# Altium schematic sheet Sheet1.SchDoc
size A1; SheetNumber: 1; SheetTotal: 1
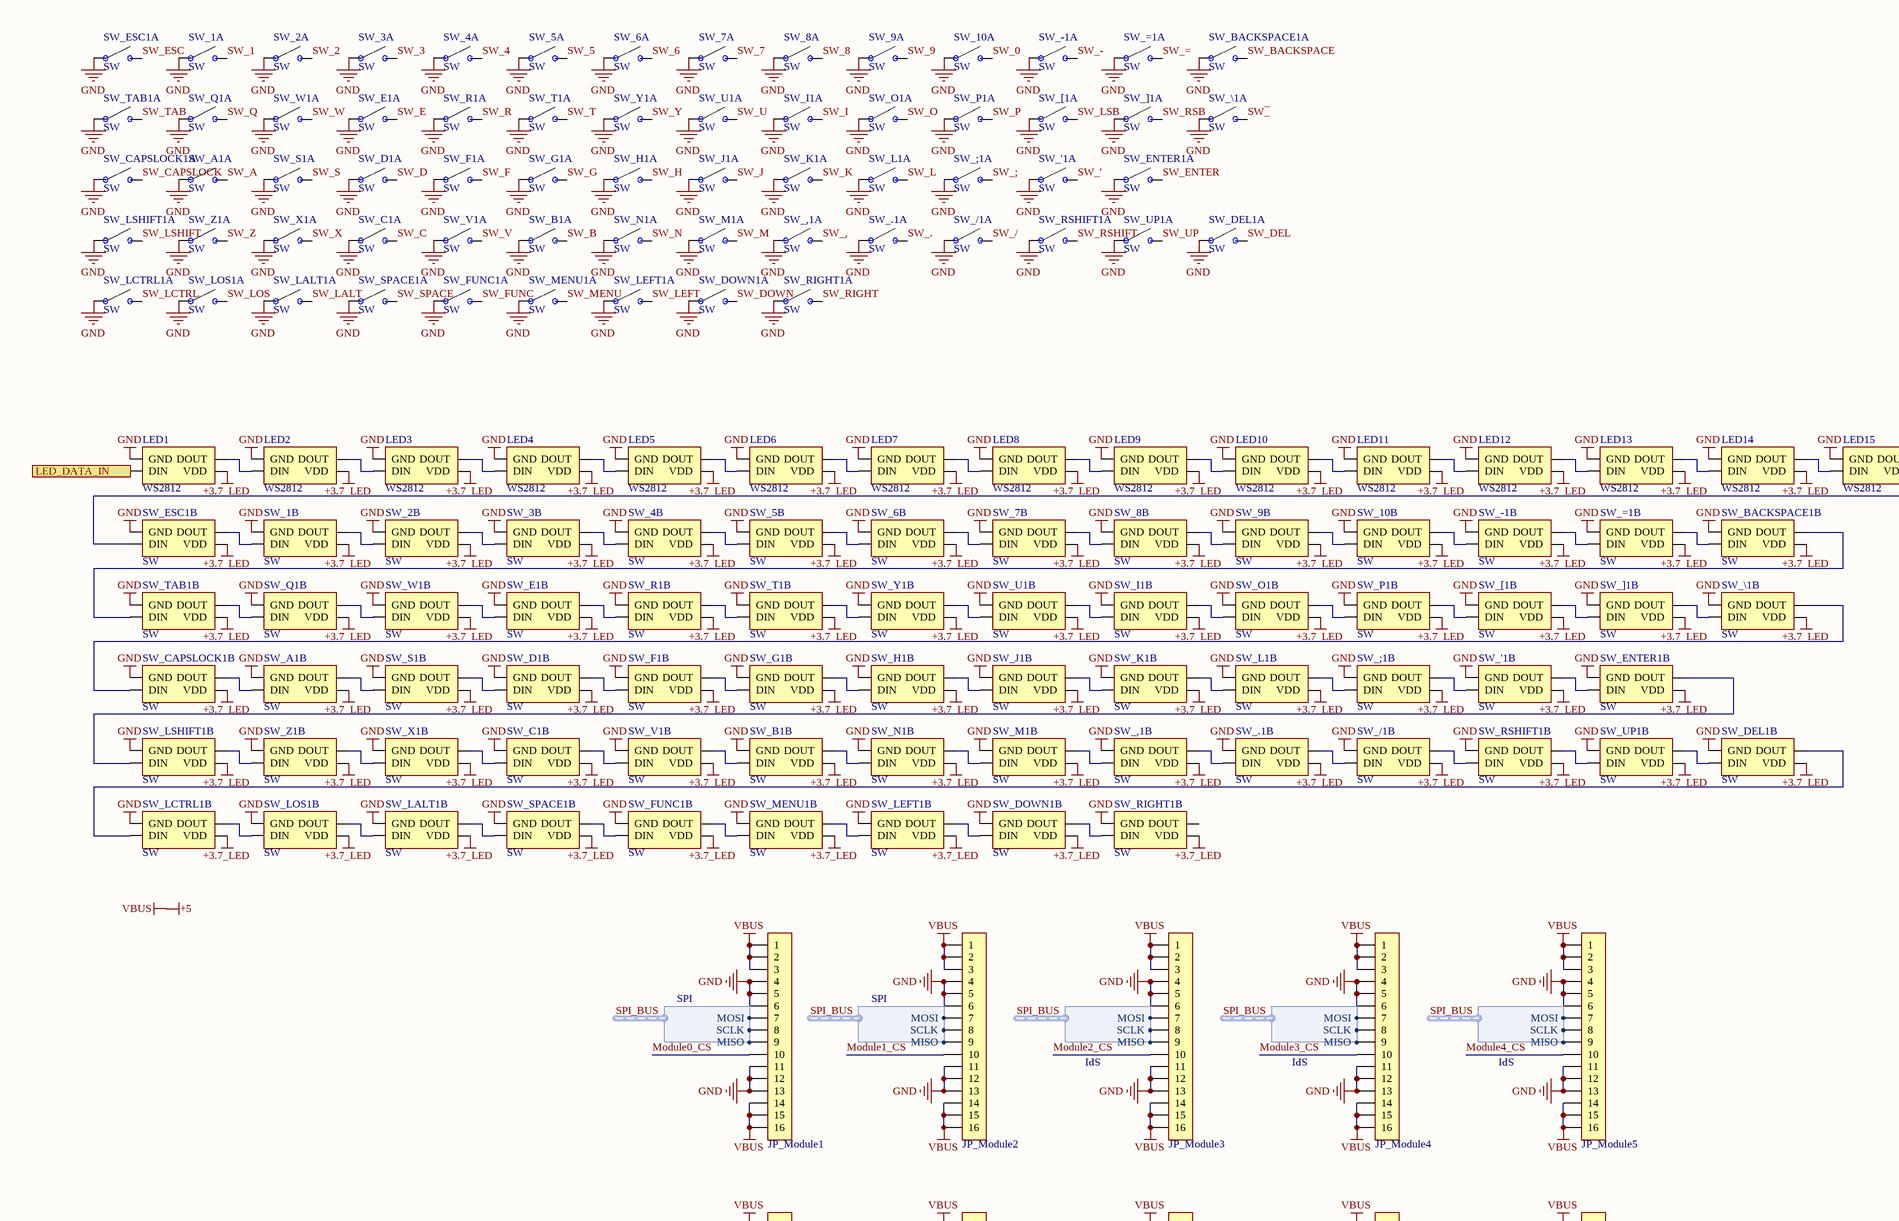
[diagram p0: Sheet1.SchDoc, top left]
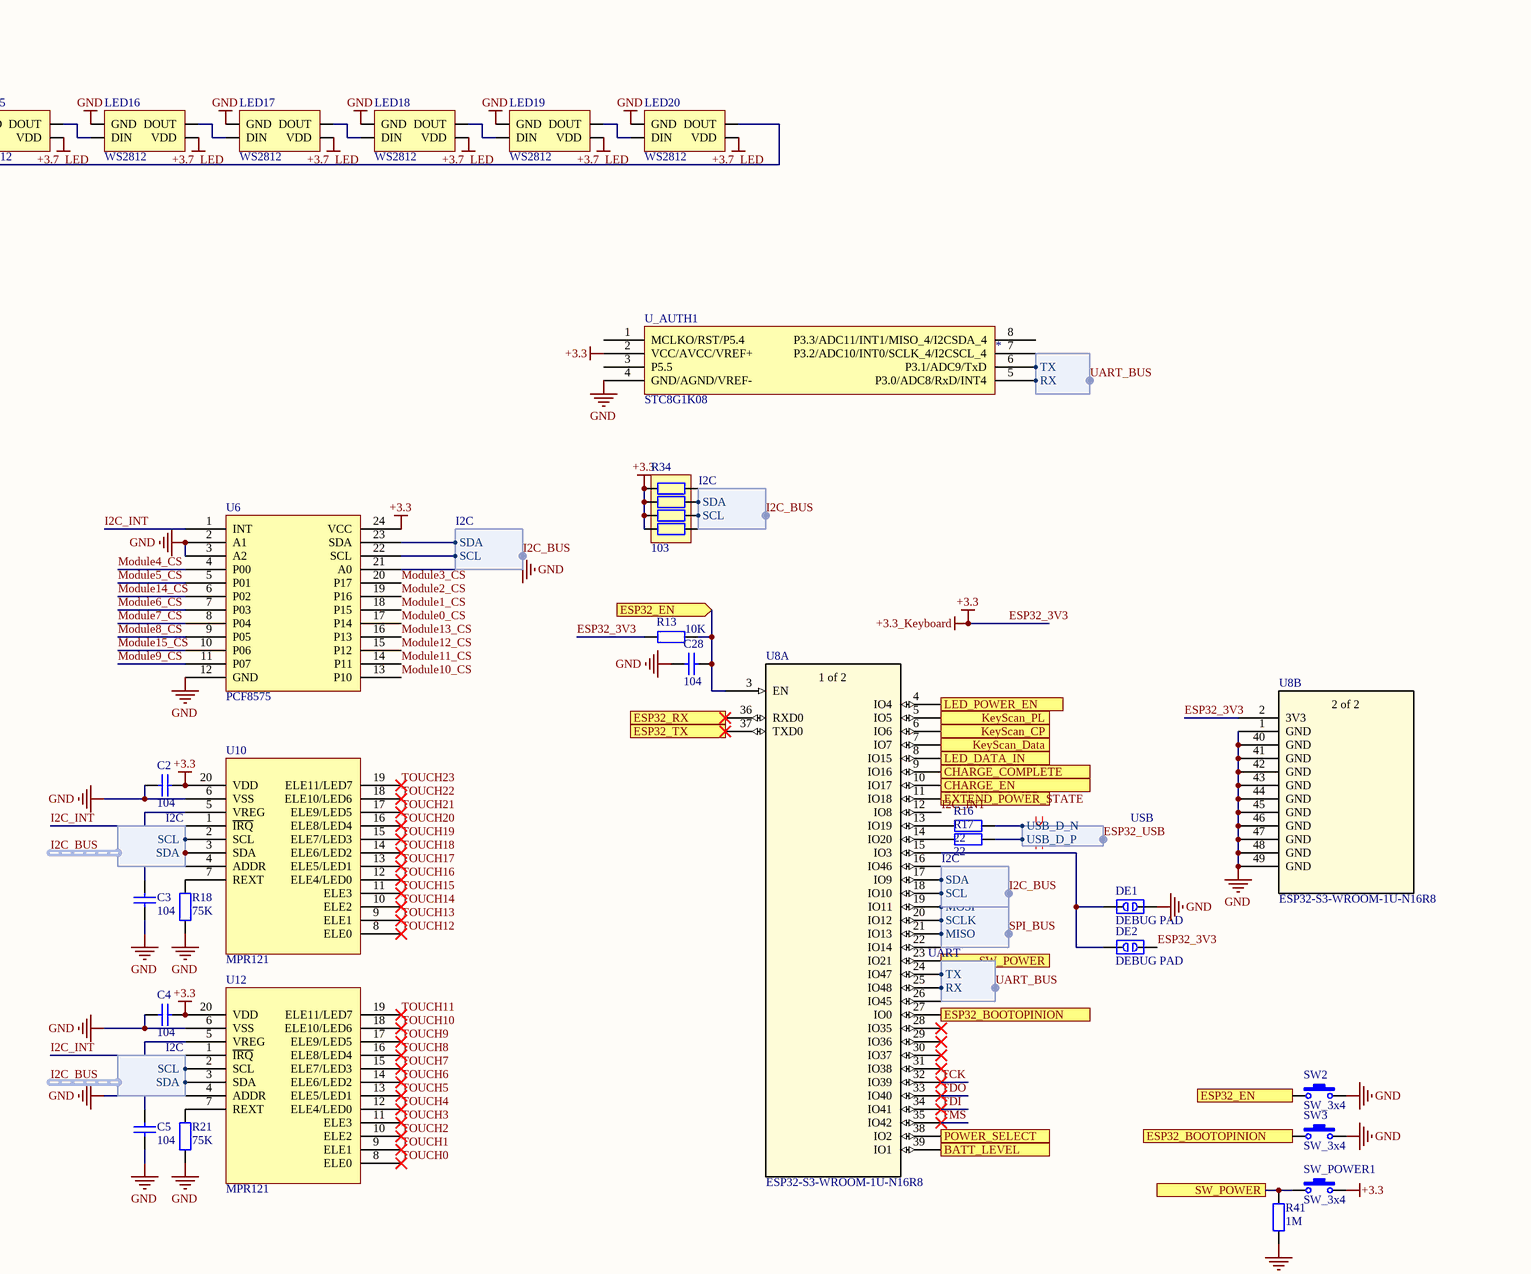
[diagram p1: Sheet1.SchDoc, top middle]
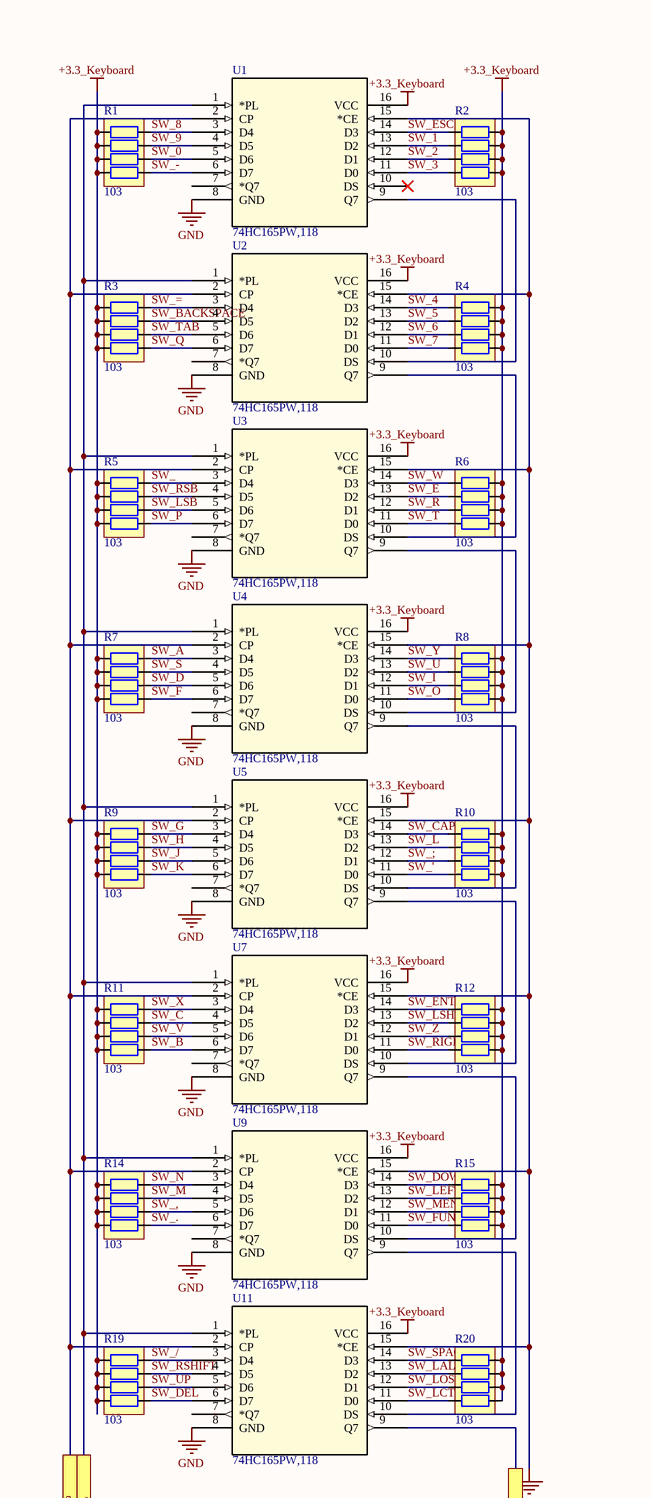
[diagram p2: Sheet1.SchDoc, top right]
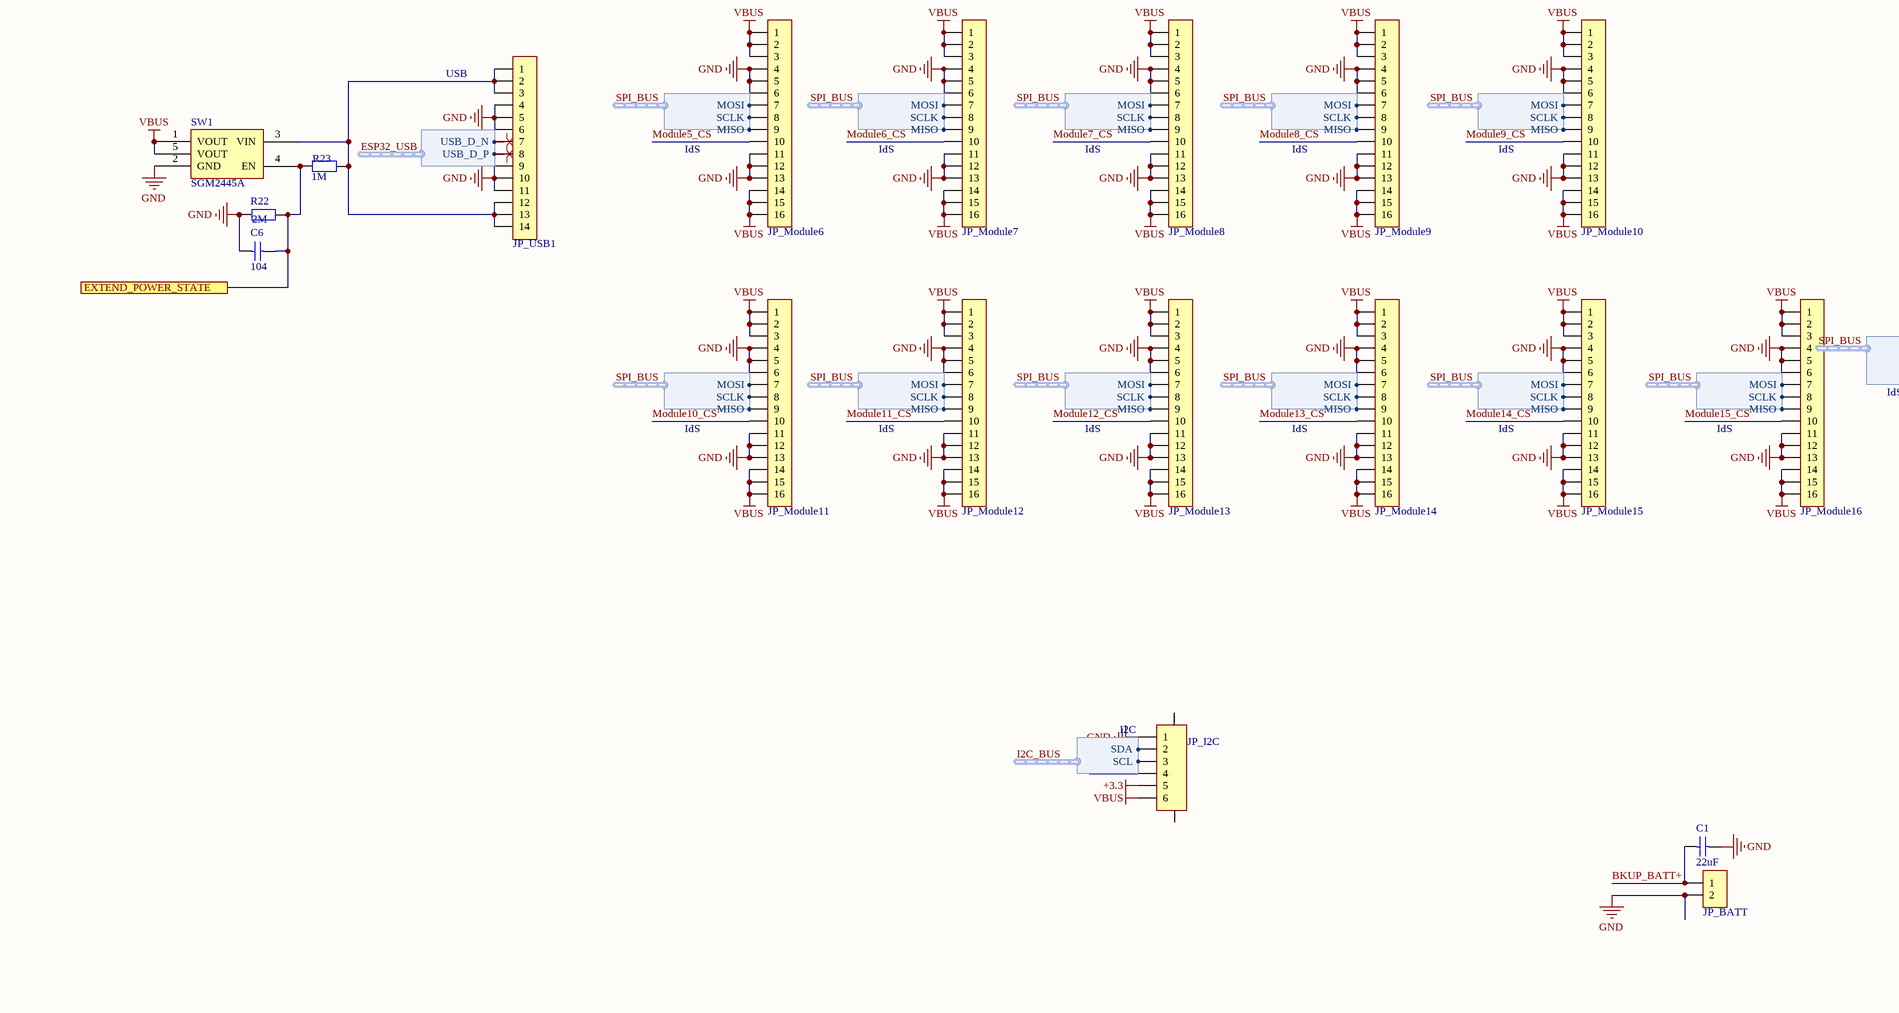
[diagram p3: Sheet1.SchDoc, bottom left]
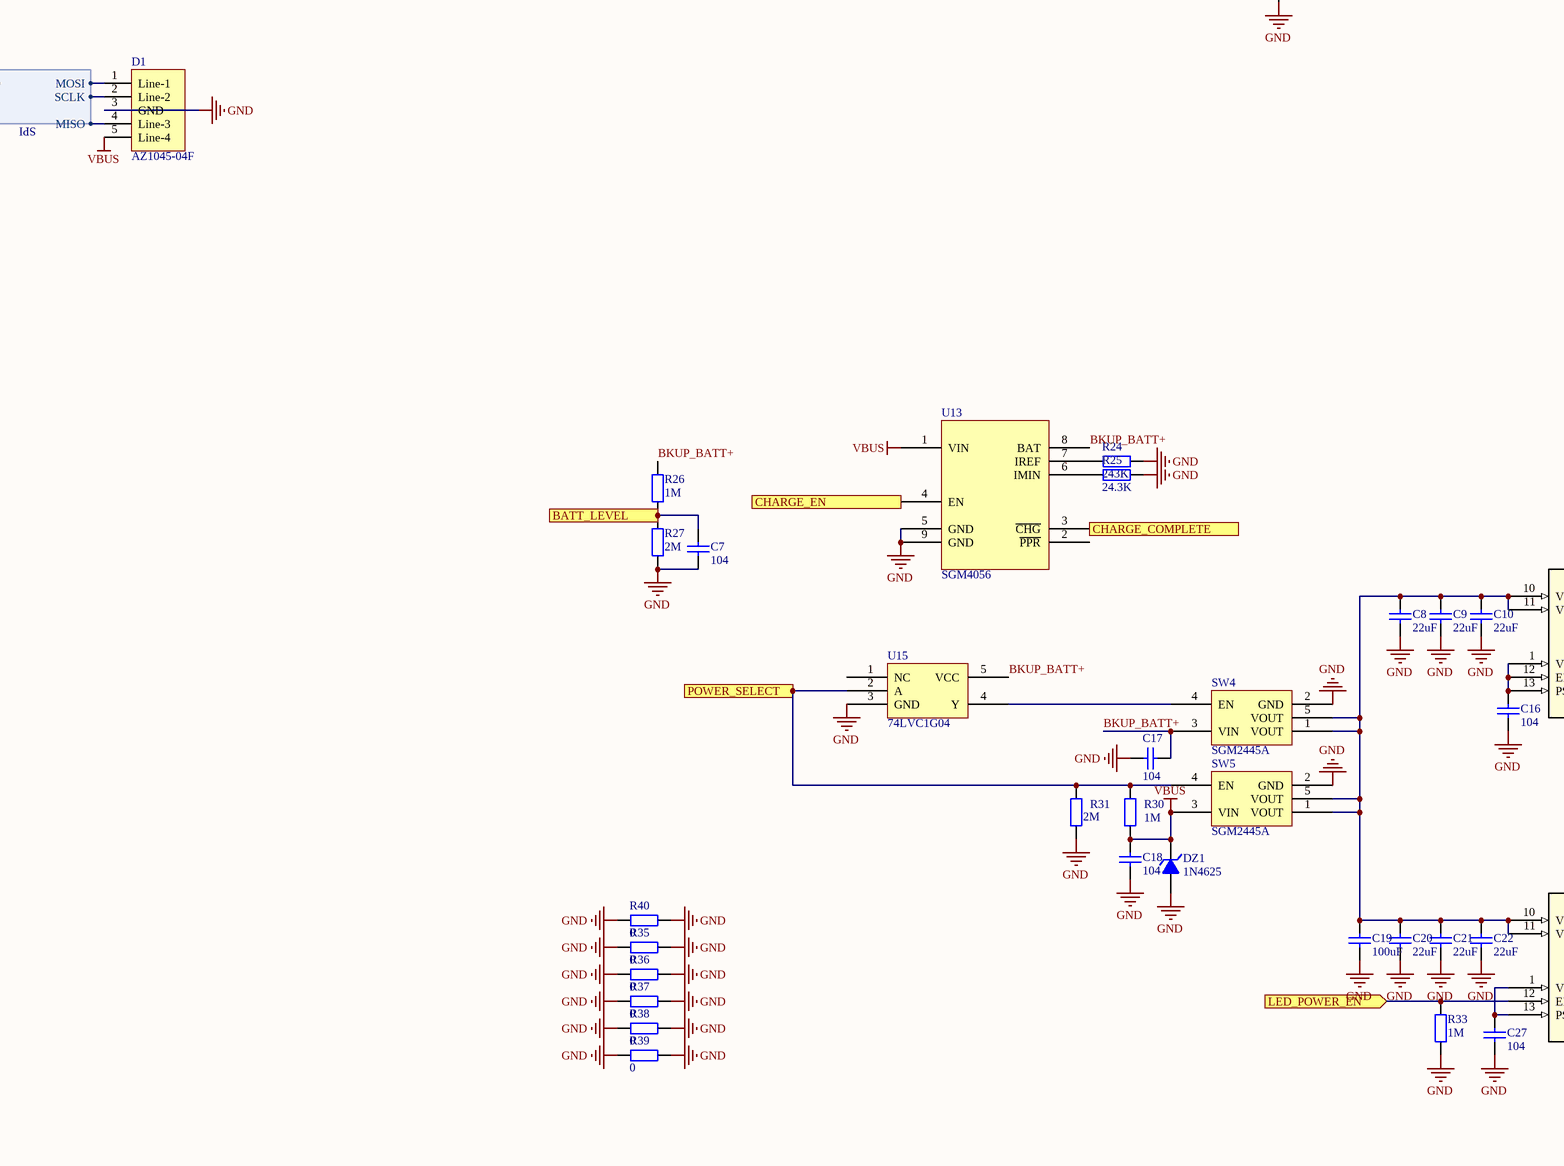
[diagram p4: Sheet1.SchDoc, bottom middle]
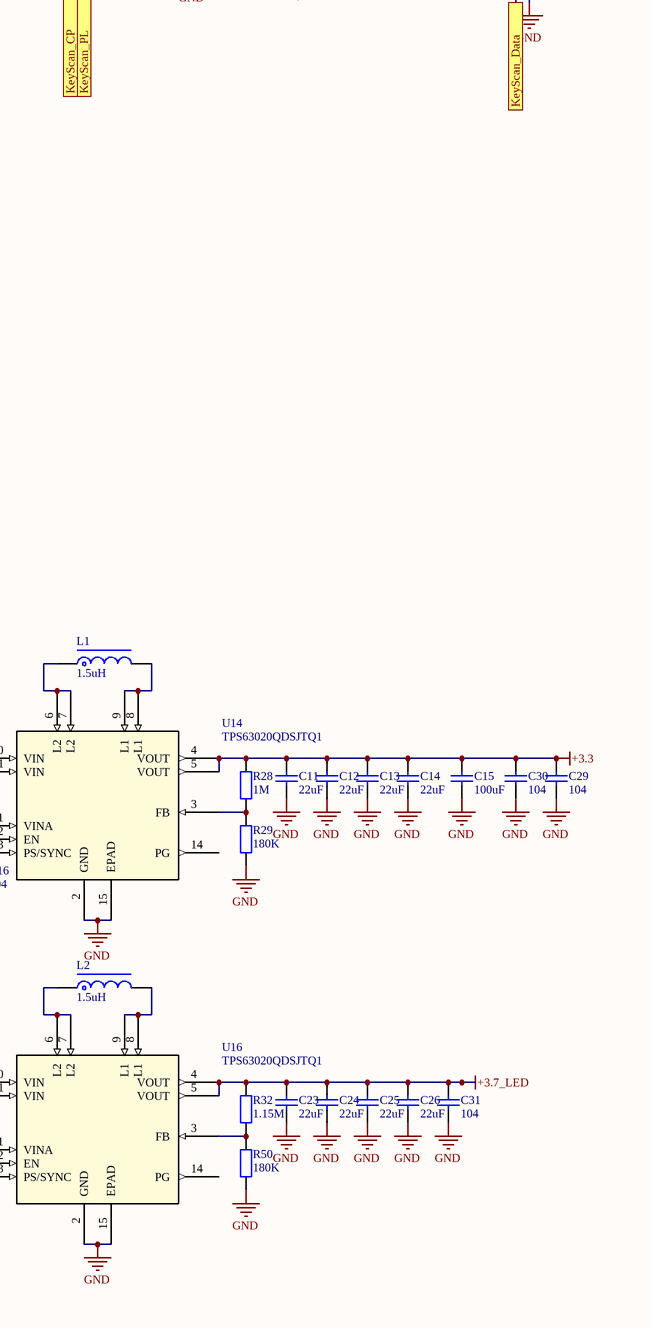
[diagram p5: Sheet1.SchDoc, bottom right]

## Parts
C1  22uF  [C0603_L_NS]
C2  104  [C0603_L_NS]
C3  104  [C0603_L_NS]
C4  104  [C0603_L_NS]
C5  104  [C0603_L_NS]
C6  104  [C0603_L_NS]
C7  104  [C0603_L_NS]
C8  22uF  [C0603_L_NS]
C9  22uF  [C0603_L_NS]
C10  22uF  [C0603_L_NS]
C11  22uF  [C0603_L_NS]
C12  22uF  [C0603_L_NS]
C13  22uF  [C0603_L_NS]
C14  22uF  [C0603_L_NS]
C15  100uF  [C1206_L]
C16  104  [C0603_L_NS]
C17  104  [C0603_L_NS]
C18  104  [C0603_L_NS]
C19  100uF  [C1206_L]
C20  22uF  [C0603_L_NS]
C21  22uF  [C0603_L_NS]
C22  22uF  [C0603_L_NS]
C23  22uF  [C0603_L_NS]
C24  22uF  [C0603_L_NS]
C25  22uF  [C0603_L_NS]
C26  22uF  [C0603_L_NS]
C27  104  [C0603_L_NS]
C28  104  [C0603_L_NS]
C29  104  [C0603_L_NS]
C30  104  [C0603_L_NS]
C31  104  [C0603_L_NS]
D1  AZ1045-04F  [ESD10]
DE1  DEBUG PAD  [DEBUG_B]
DE2  DEBUG PAD  [DEBUG_B]
DZ1  1N4625  [MINI_MELF (LL34)]
JP_BATT  HDR-1X2  [MX1.25-WS-2P]  (value not drawn)
JP_I2C  CON-6P  [FPC0.5-WT-6P]  (value not drawn)
JP_Module1  FPC1.0-16P  [FPC0.5 2H-WS-16P]  (value not drawn)
JP_Module2  FPC1.0-16P  [FPC0.5 2H-WS-16P]  (value not drawn)
JP_Module3  FPC1.0-16P  [FPC0.5 2H-WS-16P]  (value not drawn)
JP_Module4  FPC1.0-16P  [FPC0.5 2H-WS-16P]  (value not drawn)
JP_Module5  FPC1.0-16P  [FPC0.5 2H-WS-16P]  (value not drawn)
JP_Module6  FPC1.0-16P  [FPC0.5 2H-WS-16P]  (value not drawn)
JP_Module7  FPC1.0-16P  [FPC0.5 2H-WS-16P]  (value not drawn)
JP_Module8  FPC1.0-16P  [FPC0.5 2H-WS-16P]  (value not drawn)
JP_Module9  FPC1.0-16P  [FPC0.5 2H-WS-16P]  (value not drawn)
JP_Module10  FPC1.0-16P  [FPC0.5 2H-WS-16P]  (value not drawn)
JP_Module11  FPC1.0-16P  [FPC0.5 2H-WS-16P]  (value not drawn)
JP_Module12  FPC1.0-16P  [FPC0.5 2H-WS-16P]  (value not drawn)
JP_Module13  FPC1.0-16P  [FPC0.5 2H-WS-16P]  (value not drawn)
JP_Module14  FPC1.0-16P  [FPC0.5 2H-WS-16P]  (value not drawn)
JP_Module15  FPC1.0-16P  [FPC0.5 2H-WS-16P]  (value not drawn)
JP_Module16  FPC1.0-16P  [FPC0.5 2H-WS-16P]  (value not drawn)
JP_USB1  FPC1.0-14P  [FPC0.5 2H-WS-14P]  (value not drawn)
L1  1.5uH  [L-SMD-0420]
L2  1.5uH  [L-SMD-0420]
LED1  WS2812  [LED 3528-4Pin]
LED2  WS2812  [LED 3528-4Pin]
LED3  WS2812  [LED 3528-4Pin]
LED4  WS2812  [LED 3528-4Pin]
LED5  WS2812  [LED 3528-4Pin]
LED6  WS2812  [LED 3528-4Pin]
LED7  WS2812  [LED 3528-4Pin]
LED8  WS2812  [LED 3528-4Pin]
LED9  WS2812  [LED 3528-4Pin]
LED10  WS2812  [LED 3528-4Pin]
LED11  WS2812  [LED 3528-4Pin]
LED12  WS2812  [LED 3528-4Pin]
LED13  WS2812  [LED 3528-4Pin]
LED14  WS2812  [LED 3528-4Pin]
LED15  WS2812  [LED 3528-4Pin]
LED16  WS2812  [LED 3528-4Pin]
LED17  WS2812  [LED 3528-4Pin]
LED18  WS2812  [LED 3528-4Pin]
LED19  WS2812  [LED 3528-4Pin]
LED20  WS2812  [LED 3528-4Pin]
R1  103  [RCA-8P4R-0402]
R2  103  [RCA-8P4R-0402]
R3  103  [RCA-8P4R-0402]
R4  103  [RCA-8P4R-0402]
R5  103  [RCA-8P4R-0402]
R6  103  [RCA-8P4R-0402]
R7  103  [RCA-8P4R-0402]
R8  103  [RCA-8P4R-0402]
R9  103  [RCA-8P4R-0402]
R10  103  [RCA-8P4R-0402]
R11  103  [RCA-8P4R-0402]
R12  103  [RCA-8P4R-0402]
R13  10K  [R0603_L_NS]
R14  103  [RCA-8P4R-0402]
R15  103  [RCA-8P4R-0402]
R16  22  [R0603_L_NS]
R17  22  [R0603_L_NS]
R18  75K  [R0603_L_NS]
R19  103  [RCA-8P4R-0402]
R20  103  [RCA-8P4R-0402]
R21  75K  [R0603_L_NS]
R22  2M  [R0603_L_NS]
R23  1M  [R0603_L_NS]
R24  243K  [R0603_L_NS]
R25  24.3K  [R0603_L_NS]
R26  1M  [R0603_L_NS]
R27  2M  [R0603_L_NS]
R28  1M  [R0603_L_NS]
R29  180K  [R0603_L_NS]
R30  1M  [R0603_L_NS]
R31  2M  [R0603_L_NS]
R32  1.15M  [R0603_L_NS]
R33  1M  [R0603_L_NS]
R34  103  [RCA-8P4R-0402]
R35  0  [R2010_L]
R36  0  [R2010_L]
R37  0  [R2010_L]
R38  0  [R2010_L]
R39  0  [R2010_L]
R40  0  [R2010_L]
R41  1M  [R0603_L_NS]
R50  180K  [R0603_L_NS]
SW1  SGM2445A  [SOT23-5N]
SW2  SW_3x4  [SW 3*4]
SW3  SW_3x4  [SW 3*4]
SW4  SGM2445A  [SOT23-5L]
SW5  SGM2445A  [SOT23-5L]
SW_1  SW  [KeyboardSwitchModule]  (parts A,B of 2)
SW_2  SW  [KeyboardSwitchModule]  (parts A,B of 2)
SW_3  SW  [KeyboardSwitchModule]  (parts A,B of 2)
SW_4  SW  [KeyboardSwitchModule]  (parts A,B of 2)
SW_5  SW  [KeyboardSwitchModule]  (parts A,B of 2)
SW_6  SW  [KeyboardSwitchModule]  (parts A,B of 2)
SW_7  SW  [KeyboardSwitchModule]  (parts A,B of 2)
SW_8  SW  [KeyboardSwitchModule]  (parts A,B of 2)
SW_9  SW  [KeyboardSwitchModule]  (parts A,B of 2)
SW_10  SW  [KeyboardSwitchModule]  (parts A,B of 2)
SW_'1  SW  [KeyboardSwitchModule]  (parts A,B of 2)
SW_,1  SW  [KeyboardSwitchModule]  (parts A,B of 2)
SW_-1  SW  [KeyboardSwitchModule]  (parts A,B of 2)
SW_.1  SW  [KeyboardSwitchModule]  (parts A,B of 2)
SW_/1  SW  [KeyboardSwitchModule]  (parts A,B of 2)
SW_;1  SW  [KeyboardSwitchModule]  (parts A,B of 2)
SW_=1  SW  [KeyboardSwitchModule]  (parts A,B of 2)
SW_[1  SW  [KeyboardSwitchModule]  (parts A,B of 2)
SW_\1  SW  [KeyboardSwitchModule]  (parts A,B of 2)
SW_]1  SW  [KeyboardSwitchModule]  (parts A,B of 2)
SW_A1  SW  [KeyboardSwitchModule]  (parts A,B of 2)
SW_B1  SW  [KeyboardSwitchModule]  (parts A,B of 2)
SW_BACKSPACE1  SW  [KeyboardSwitchModule]  (parts A,B of 2)
SW_C1  SW  [KeyboardSwitchModule]  (parts A,B of 2)
SW_CAPSLOCK1  SW  [KeyboardSwitchModule]  (parts A,B of 2)
SW_D1  SW  [KeyboardSwitchModule]  (parts A,B of 2)
SW_DEL1  SW  [KeyboardSwitchModule]  (parts A,B of 2)
SW_DOWN1  SW  [KeyboardSwitchModule]  (parts A,B of 2)
SW_E1  SW  [KeyboardSwitchModule]  (parts A,B of 2)
SW_ENTER1  SW  [KeyboardSwitchModule]  (parts A,B of 2)
SW_ESC1  SW  [KeyboardSwitchModule]  (parts A,B of 2)
SW_F1  SW  [KeyboardSwitchModule]  (parts A,B of 2)
SW_FUNC1  SW  [KeyboardSwitchModule]  (parts A,B of 2)
SW_G1  SW  [KeyboardSwitchModule]  (parts A,B of 2)
SW_H1  SW  [KeyboardSwitchModule]  (parts A,B of 2)
SW_I1  SW  [KeyboardSwitchModule]  (parts A,B of 2)
SW_J1  SW  [KeyboardSwitchModule]  (parts A,B of 2)
SW_K1  SW  [KeyboardSwitchModule]  (parts A,B of 2)
SW_L1  SW  [KeyboardSwitchModule]  (parts A,B of 2)
SW_LALT1  SW  [KeyboardSwitchModule]  (parts A,B of 2)
SW_LCTRL1  SW  [KeyboardSwitchModule]  (parts A,B of 2)
SW_LEFT1  SW  [KeyboardSwitchModule]  (parts A,B of 2)
SW_LOS1  SW  [KeyboardSwitchModule]  (parts A,B of 2)
SW_LSHIFT1  SW  [KeyboardSwitchModule]  (parts A,B of 2)
SW_M1  SW  [KeyboardSwitchModule]  (parts A,B of 2)
SW_MENU1  SW  [KeyboardSwitchModule]  (parts A,B of 2)
SW_N1  SW  [KeyboardSwitchModule]  (parts A,B of 2)
SW_O1  SW  [KeyboardSwitchModule]  (parts A,B of 2)
SW_P1  SW  [KeyboardSwitchModule]  (parts A,B of 2)
SW_POWER1  SW_3x4  [SW 3*4]
SW_Q1  SW  [KeyboardSwitchModule]  (parts A,B of 2)
SW_R1  SW  [KeyboardSwitchModule]  (parts A,B of 2)
SW_RIGHT1  SW  [KeyboardSwitchModule]  (parts A,B of 2)
SW_RSHIFT1  SW  [KeyboardSwitchModule]  (parts A,B of 2)
SW_S1  SW  [KeyboardSwitchModule]  (parts A,B of 2)
SW_SPACE1  SW  [KeyboardSwitchModule]  (parts A,B of 2)
SW_T1  SW  [KeyboardSwitchModule]  (parts A,B of 2)
SW_TAB1  SW  [KeyboardSwitchModule]  (parts A,B of 2)
SW_U1  SW  [KeyboardSwitchModule]  (parts A,B of 2)
SW_UP1  SW  [KeyboardSwitchModule]  (parts A,B of 2)
SW_V1  SW  [KeyboardSwitchModule]  (parts A,B of 2)
SW_W1  SW  [KeyboardSwitchModule]  (parts A,B of 2)
SW_X1  SW  [KeyboardSwitchModule]  (parts A,B of 2)
SW_Y1  SW  [KeyboardSwitchModule]  (parts A,B of 2)
SW_Z1  SW  [KeyboardSwitchModule]  (parts A,B of 2)
U1  74HC165PW,118  [TSSOP16_N]
U2  74HC165PW,118  [TSSOP16_N]
U3  74HC165PW,118  [TSSOP16_N]
U4  74HC165PW,118  [TSSOP16_N]
U5  74HC165PW,118  [TSSOP16_N]
U6  PCF8575  [SSOP24_N]
U7  74HC165PW,118  [TSSOP16_N]
U8  ESP32-S3-WROOM-1U-N16R8  [ESP32璖3璚ROOM?U_EXP]  (parts A,B of 2)
U9  74HC165PW,118  [TSSOP16_N]
U10  MPR121  [QFN20 3X3]
U11  74HC165PW,118  [TSSOP16_N]
U12  MPR121  [QFN20 3X3]
U13  SGM4056  [TDFN-2*2-8L]
U14  TPS63020QDSJTQ1  [DSJ14_2P85X1P58_TEX]
U15  74LVC1G04  [SOT23-5L]
U16  TPS63020QDSJTQ1  [DSJ14_2P85X1P58_TEX]
U_AUTH1  STC8G1K08  [TDFN-3*3-8L]

## Ports
BATT_LEVEL, CHARGE_COMPLETE, CHARGE_EN, ESP32_BOOTOPINION (in), ESP32_BOOTOPINION (out), ESP32_EN (in), ESP32_EN (out), ESP32_RX (in), ESP32_TX (out), EXTEND_POWER_STATE, KeyScan_CP, KeyScan_Data, KeyScan_PL, LED_DATA_IN (in), LED_DATA_IN (out), LED_POWER_EN (in), POWER_SELECT, SW_POWER

## Harnesses
SPI: SCLK, MISO, MOSI
SPI: SCLK, MOSI, MISO
USB: USB_D_P, USB_D_N
I2C: SCL, SDA
*: TX, RX
UART: TX, RX

## Nets
+3.7_LED: C23.2 C24.2 C25.2 C26.2 C31.2 LED1.3(VDD) LED2.3(VDD) LED3.3(VDD) LED4.3(VDD) LED5.3(VDD) LED6.3(VDD) LED7.3(VDD) LED8.3(VDD) LED9.3(VDD) LED10.3(VDD) LED11.3(VDD) LED12.3(VDD) LED13.3(VDD) LED14.3(VDD) LED15.3(VDD) LED16.3(VDD) LED17.3(VDD) LED18.3(VDD) LED19.3(VDD) LED20.3(VDD) R32.2 SW_1.5(VDD) SW_2.5(VDD) SW_3.5(VDD) SW_4.5(VDD) SW_5.5(VDD) SW_6.5(VDD) SW_7.5(VDD) SW_8.5(VDD) SW_9.5(VDD) SW_10.5(VDD) SW_'1.5(VDD) SW_,1.5(VDD) SW_-1.5(VDD) SW_.1.5(VDD) SW_/1.5(VDD) SW_;1.5(VDD) SW_=1.5(VDD) SW_[1.5(VDD) SW_\1.5(VDD) SW_]1.5(VDD) SW_A1.5(VDD) SW_B1.5(VDD) SW_BACKSPACE1.5(VDD) SW_C1.5(VDD) SW_CAPSLOCK1.5(VDD) SW_D1.5(VDD) SW_DEL1.5(VDD) SW_DOWN1.5(VDD) SW_E1.5(VDD) SW_ENTER1.5(VDD) SW_ESC1.5(VDD) SW_F1.5(VDD) SW_FUNC1.5(VDD) SW_G1.5(VDD) SW_H1.5(VDD) SW_I1.5(VDD) SW_J1.5(VDD) SW_K1.5(VDD) SW_L1.5(VDD) SW_LALT1.5(VDD) SW_LCTRL1.5(VDD) SW_LEFT1.5(VDD) SW_LOS1.5(VDD) SW_LSHIFT1.5(VDD) SW_M1.5(VDD) SW_MENU1.5(VDD) SW_N1.5(VDD) SW_O1.5(VDD) SW_P1.5(VDD) SW_Q1.5(VDD) SW_R1.5(VDD) SW_RIGHT1.5(VDD) SW_RSHIFT1.5(VDD) SW_S1.5(VDD) SW_SPACE1.5(VDD) SW_T1.5(VDD) SW_TAB1.5(VDD) SW_U1.5(VDD) SW_UP1.5(VDD) SW_V1.5(VDD) SW_W1.5(VDD) SW_X1.5(VDD) SW_Y1.5(VDD) SW_Z1.5(VDD) U16.4(VOUT) U16.5(VOUT)
+5: C18.2 D1.5(Line-4) DZ1.2(K) JP_I2C.6 JP_Module1.1 JP_Module1.2 JP_Module1.3 JP_Module1.14 JP_Module1.15 JP_Module1.16 JP_Module2.1 JP_Module2.2 JP_Module2.3 JP_Module2.14 JP_Module2.15 JP_Module2.16 JP_Module3.1 JP_Module3.2 JP_Module3.3 JP_Module3.14 JP_Module3.15 JP_Module3.16 JP_Module4.1 JP_Module4.2 JP_Module4.3 JP_Module4.14 JP_Module4.15 JP_Module4.16 JP_Module5.1 JP_Module5.2 JP_Module5.3 JP_Module5.14 JP_Module5.15 JP_Module5.16 JP_Module6.1 JP_Module6.2 JP_Module6.3 JP_Module6.14 JP_Module6.15 JP_Module6.16 JP_Module7.1 JP_Module7.2 JP_Module7.3 JP_Module7.14 JP_Module7.15 JP_Module7.16 JP_Module8.1 JP_Module8.2 JP_Module8.3 JP_Module8.14 JP_Module8.15 JP_Module8.16 JP_Module9.1 JP_Module9.2 JP_Module9.3 JP_Module9.14 JP_Module9.15 JP_Module9.16 JP_Module10.1 JP_Module10.2 JP_Module10.3 JP_Module10.14 JP_Module10.15 JP_Module10.16 JP_Module11.1 JP_Module11.2 JP_Module11.3 JP_Module11.14 JP_Module11.15 JP_Module11.16 JP_Module12.1 JP_Module12.2 JP_Module12.3 JP_Module12.14 JP_Module12.15 JP_Module12.16 JP_Module13.1 JP_Module13.2 JP_Module13.3 JP_Module13.14 JP_Module13.15 JP_Module13.16 JP_Module14.1 JP_Module14.2 JP_Module14.3 JP_Module14.14 JP_Module14.15 JP_Module14.16 JP_Module15.1 JP_Module15.2 JP_Module15.3 JP_Module15.14 JP_Module15.15 JP_Module15.16 JP_Module16.1 JP_Module16.2 JP_Module16.3 JP_Module16.14 JP_Module16.15 JP_Module16.16 R30.2 SW1.1(VOUT) SW1.5(VOUT) SW5.3(VIN) U13.1(VIN)  [also labelled VBUS]
ESP32_3V3: C2.2 C4.2 C11.2 C12.2 C13.2 C14.2 C15.2 C29.2 C30.2 DE2.2 JP_I2C.5 R1.1 R1.2 R1.3 R1.4 R2.5 R2.6 R2.7 R2.8 R3.1 R3.2 R3.3 R3.4 R4.5 R4.6 R4.7 R4.8 R5.1 R5.2 R5.3 R5.4 R6.5 R6.6 R6.7 R6.8 R7.1 R7.2 R7.3 R7.4 R8.5 R8.6 R8.7 R8.8 R9.1 R9.2 R9.3 R9.4 R10.5 R10.6 R10.7 R10.8 R11.1 R11.2 R11.3 R11.4 R12.5 R12.6 R12.7 R12.8 R13.1 R14.1 R14.2 R14.3 R14.4 R15.5 R15.6 R15.7 R15.8 R19.1 R19.2 R19.3 R19.4 R20.5 R20.6 R20.7 R20.8 R28.2 R34.1 R34.2 R34.3 R34.4 SW_POWER1.2 U1.16(VCC) U2.16(VCC) U3.16(VCC) U4.16(VCC) U5.16(VCC) U6.24(VCC) U7.16(VCC) U8.2(3V3) U9.16(VCC) U10.20(VDD) U11.16(VCC) U12.20(VDD) U14.4(VOUT) U14.5(VOUT) U_AUTH1.2(VCC/AVCC/VREF+)  [also labelled +3.3, +3.3_Keyboard]
GND: C1.1 C2.1 C3.1 C4.1 C5.1 C6.1 C7.1 C8.1 C9.1 C10.1 C11.1 C12.1 C13.1 C14.1 C15.1 C16.1 C17.2 C18.1 C19.1 C20.1 C21.1 C22.1 C23.1 C24.1 C25.1 C26.1 C27.1 C28.1 C29.1 C30.1 C31.1 D1.3(GND) DE1.2 DZ1.1(A) JP_BATT.2 JP_I2C.1 JP_Module1.4 JP_Module1.5 JP_Module1.6 JP_Module1.11 JP_Module1.12 JP_Module1.13 JP_Module2.4 JP_Module2.5 JP_Module2.6 JP_Module2.11 JP_Module2.12 JP_Module2.13 JP_Module3.4 JP_Module3.5 JP_Module3.6 JP_Module3.11 JP_Module3.12 JP_Module3.13 JP_Module4.4 JP_Module4.5 JP_Module4.6 JP_Module4.11 JP_Module4.12 JP_Module4.13 JP_Module5.4 JP_Module5.5 JP_Module5.6 JP_Module5.11 JP_Module5.12 JP_Module5.13 JP_Module6.4 JP_Module6.5 JP_Module6.6 JP_Module6.11 JP_Module6.12 JP_Module6.13 JP_Module7.4 JP_Module7.5 JP_Module7.6 JP_Module7.11 JP_Module7.12 JP_Module7.13 JP_Module8.4 JP_Module8.5 JP_Module8.6 JP_Module8.11 JP_Module8.12 JP_Module8.13 JP_Module9.4 JP_Module9.5 JP_Module9.6 JP_Module9.11 JP_Module9.12 JP_Module9.13 JP_Module10.4 JP_Module10.5 JP_Module10.6 JP_Module10.11 JP_Module10.12 JP_Module10.13 JP_Module11.4 JP_Module11.5 JP_Module11.6 JP_Module11.11 JP_Module11.12 JP_Module11.13 JP_Module12.4 JP_Module12.5 JP_Module12.6 JP_Module12.11 JP_Module12.12 JP_Module12.13 JP_Module13.4 JP_Module13.5 JP_Module13.6 JP_Module13.11 JP_Module13.12 JP_Module13.13 JP_Module14.4 JP_Module14.5 JP_Module14.6 JP_Module14.11 JP_Module14.12 JP_Module14.13 JP_Module15.4 JP_Module15.5 JP_Module15.6 JP_Module15.11 JP_Module15.12 JP_Module15.13 JP_Module16.4 JP_Module16.5 JP_Module16.6 JP_Module16.11 JP_Module16.12 JP_Module16.13 JP_USB1.4 JP_USB1.5 JP_USB1.6 JP_USB1.9 JP_USB1.10 JP_USB1.11 LED1.1(GND) LED2.1(GND) LED3.1(GND) LED4.1(GND) LED5.1(GND) LED6.1(GND) LED7.1(GND) LED8.1(GND) LED9.1(GND) LED10.1(GND) LED11.1(GND) LED12.1(GND) LED13.1(GND) LED14.1(GND) LED15.1(GND) LED16.1(GND) LED17.1(GND) LED18.1(GND) LED19.1(GND) LED20.1(GND) R18.1 R21.1 R22.1 R24.2 R25.2 R27.1 R29.1 R31.1 R33.1 R35.1 R35.2 R36.1 R36.2 R37.1 R37.2 R38.1 R38.2 R39.1 R39.2 R40.1 R40.2 R41.1 R50.1 SW1.2(GND) SW2.2 SW3.2 SW4.2(GND) SW5.2(GND) SW_1.1 SW_1.3(GND) SW_1.7(GND) SW_2.1 SW_2.3(GND) SW_2.7(GND) SW_3.1 SW_3.3(GND) SW_3.7(GND) SW_4.1 SW_4.3(GND) SW_4.7(GND) SW_5.1 SW_5.3(GND) SW_5.7(GND) SW_6.1 SW_6.3(GND) SW_6.7(GND) SW_7.1 SW_7.3(GND) SW_7.7(GND) SW_8.1 SW_8.3(GND) SW_8.7(GND) SW_9.1 SW_9.3(GND) SW_9.7(GND) SW_10.1 SW_10.3(GND) SW_10.7(GND) SW_'1.1 SW_'1.3(GND) SW_'1.7(GND) SW_,1.1 SW_,1.3(GND) SW_,1.7(GND) SW_-1.1 SW_-1.3(GND) SW_-1.7(GND) SW_.1.1 SW_.1.3(GND) SW_.1.7(GND) SW_/1.1 SW_/1.3(GND) SW_/1.7(GND) SW_;1.1 SW_;1.3(GND) SW_;1.7(GND) SW_=1.1 SW_=1.3(GND) SW_=1.7(GND) SW_[1.1 SW_[1.3(GND) SW_[1.7(GND) SW_\1.1 SW_\1.3(GND) SW_\1.7(GND) SW_]1.1 SW_]1.3(GND) SW_]1.7(GND) SW_A1.1 SW_A1.3(GND) SW_A1.7(GND) SW_B1.1 SW_B1.3(GND) SW_B1.7(GND) SW_BACKSPACE1.1 SW_BACKSPACE1.3(GND) SW_BACKSPACE1.7(GND) SW_C1.1 SW_C1.3(GND) SW_C1.7(GND) SW_CAPSLOCK1.1 SW_CAPSLOCK1.3(GND) SW_CAPSLOCK1.7(GND) SW_D1.1 SW_D1.3(GND) SW_D1.7(GND) SW_DEL1.1 SW_DEL1.3(GND) SW_DEL1.7(GND) SW_DOWN1.1 SW_DOWN1.3(GND) SW_DOWN1.7(GND) SW_E1.1 SW_E1.3(GND) SW_E1.7(GND) SW_ENTER1.1 SW_ENTER1.3(GND) SW_ENTER1.7(GND) SW_ESC1.1 SW_ESC1.3(GND) SW_ESC1.7(GND) SW_F1.1 SW_F1.3(GND) SW_F1.7(GND) SW_FUNC1.1 SW_FUNC1.3(GND) SW_FUNC1.7(GND) SW_G1.1 SW_G1.3(GND) SW_G1.7(GND) SW_H1.1 SW_H1.3(GND) SW_H1.7(GND) SW_I1.1 SW_I1.3(GND) SW_I1.7(GND) SW_J1.1 SW_J1.3(GND) SW_J1.7(GND) SW_K1.1 SW_K1.3(GND) SW_K1.7(GND) SW_L1.1 SW_L1.3(GND) SW_L1.7(GND) SW_LALT1.1 SW_LALT1.3(GND) SW_LALT1.7(GND) SW_LCTRL1.1 SW_LCTRL1.3(GND) SW_LCTRL1.7(GND) SW_LEFT1.1 SW_LEFT1.3(GND) SW_LEFT1.7(GND) SW_LOS1.1 SW_LOS1.3(GND) SW_LOS1.7(GND) SW_LSHIFT1.1 SW_LSHIFT1.3(GND) SW_LSHIFT1.7(GND) SW_M1.1 SW_M1.3(GND) SW_M1.7(GND) SW_MENU1.1 SW_MENU1.3(GND) SW_MENU1.7(GND) SW_N1.1 SW_N1.3(GND) SW_N1.7(GND) SW_O1.1 SW_O1.3(GND) SW_O1.7(GND) SW_P1.1 SW_P1.3(GND) SW_P1.7(GND) SW_Q1.1 SW_Q1.3(GND) SW_Q1.7(GND) SW_R1.1 SW_R1.3(GND) SW_R1.7(GND) SW_RIGHT1.1 SW_RIGHT1.3(GND) SW_RIGHT1.7(GND) SW_RSHIFT1.1 SW_RSHIFT1.3(GND) SW_RSHIFT1.7(GND) SW_S1.1 SW_S1.3(GND) SW_S1.7(GND) SW_SPACE1.1 SW_SPACE1.3(GND) SW_SPACE1.7(GND) SW_T1.1 SW_T1.3(GND) SW_T1.7(GND) SW_TAB1.1 SW_TAB1.3(GND) SW_TAB1.7(GND) SW_U1.1 SW_U1.3(GND) SW_U1.7(GND) SW_UP1.1 SW_UP1.3(GND) SW_UP1.7(GND) SW_V1.1 SW_V1.3(GND) SW_V1.7(GND) SW_W1.1 SW_W1.3(GND) SW_W1.7(GND) SW_X1.1 SW_X1.3(GND) SW_X1.7(GND) SW_Y1.1 SW_Y1.3(GND) SW_Y1.7(GND) SW_Z1.1 SW_Z1.3(GND) SW_Z1.7(GND) U1.8(GND) U1.15(*CE) U2.8(GND) U2.15(*CE) U3.8(GND) U3.15(*CE) U4.8(GND) U4.15(*CE) U5.8(GND) U5.15(*CE) U6.2(A1) U6.3(A2) U6.12(GND) U6.21(A0) U7.8(GND) U7.15(*CE) U8.1(GND) U8.40(GND) U8.41(GND) U8.42(GND) U8.43(GND) U8.44(GND) U8.45(GND) U8.46(GND) U8.47(GND) U8.48(GND) U8.49(GND) U9.8(GND) U9.15(*CE) U10.6(VSS) U11.8(GND) U11.15(*CE) U12.4(ADDR) U12.6(VSS) U13.5(GND) U13.9(GND) U14.2(GND) U14.15(EPAD) U15.3(GND) U16.2(GND) U16.15(EPAD) U_AUTH1.4(GND/AGND/VREF-)
BATT_LEVEL: C7.2 R26.1 R27.2 U8.39(IO1) ; port BATT_LEVEL
BKUP_BATT+: C1.2 C17.1 JP_BATT.1 R26.2 SW4.3(VIN) U13.8(BAT) U15.5(VCC)
CHARGE_COMPLETE: U8.9(IO16) U13.3(~{CHG}) ; port CHARGE_COMPLETE
CHARGE_EN: U8.10(IO17) U13.4(EN) ; port CHARGE_EN
ESP32_BOOTOPINION: SW3.1 U8.27(IO0) ; port ESP32_BOOTOPINION
ESP32_EN: C28.2 R13.2 SW2.1 U8.3(EN) ; port ESP32_EN
ESP32_RX: U8.36(RXD0) ; port ESP32_RX
ESP32_TX: U8.37(TXD0) ; port ESP32_TX
ESP32_USB.USB_D_N: JP_USB1.7 R16.2 ; harness USB.USB_D_N
ESP32_USB.USB_D_P: JP_USB1.8 R17.2 ; harness USB.USB_D_P
EXTEND_POWER_STATE: C6.2 R22.2 R23.1 SW1.4(EN) U8.11(IO18) ; port EXTEND_POWER_STATE
I2C_BUS.SCL: JP_I2C.3 R34.6 U6.22(SCL) U8.18(IO10) U10.2(SCL) U12.2(SCL) ; harness I2C.SCL
I2C_BUS.SDA: JP_I2C.2 R34.7 U6.23(SDA) U8.17(IO9) U10.3(SDA) U10.4(ADDR) U12.3(SDA) ; harness I2C.SDA
I2C_INT: JP_I2C.4 R34.5 U6.1(INT) U8.12(IO8) U10.1(~{IRQ}) U12.1(~{IRQ})
KeyScan_CP: U1.2(CP) U2.2(CP) U3.2(CP) U4.2(CP) U5.2(CP) U7.2(CP) U8.6(IO6) U9.2(CP) U11.2(CP) ; port KeyScan_CP
KeyScan_Data: U8.7(IO7) U11.9(Q7) ; port KeyScan_Data
KeyScan_PL: U1.1(*PL) U2.1(*PL) U3.1(*PL) U4.1(*PL) U5.1(*PL) U7.1(*PL) U8.5(IO5) U9.1(*PL) U11.1(*PL) ; port KeyScan_PL
LED_DATA_IN: LED1.2(DIN) U8.8(IO15) ; port LED_DATA_IN
LED_POWER_EN: R33.2 U8.4(IO4) U16.12(EN) ; port LED_POWER_EN
Module0_CS: JP_Module1.10 U6.17(P14)
Module1_CS: JP_Module2.10 U6.18(P15)
Module2_CS: JP_Module3.10 U6.19(P16)
Module3_CS: JP_Module4.10 U6.20(P17)
Module4_CS: JP_Module5.10 U6.4(P00)
Module5_CS: JP_Module6.10 U6.5(P01)
Module6_CS: JP_Module7.10 U6.7(P03)
Module7_CS: JP_Module8.10 U6.8(P04)
Module8_CS: JP_Module9.10 U6.9(P05)
Module9_CS: JP_Module10.10 U6.11(P07)
Module10_CS: JP_Module11.10 U6.13(P10)
Module11_CS: JP_Module12.10 U6.14(P11)
Module12_CS: JP_Module13.10 U6.15(P12)
Module13_CS: JP_Module14.10 U6.16(P13)
Module14_CS: JP_Module15.10 U6.6(P02)
Module15_CS: JP_Module16.10 U6.10(P06)
POWER_SELECT: R30.1 R31.2 SW5.4(EN) U8.38(IO2) U15.2(A) ; port POWER_SELECT
SPI_BUS.MISO: D1.4(Line-3) JP_Module1.9 JP_Module2.9 JP_Module3.9 JP_Module4.9 JP_Module5.9 JP_Module6.9 JP_Module7.9 JP_Module8.9 JP_Module9.9 JP_Module10.9 JP_Module11.9 JP_Module12.9 JP_Module13.9 JP_Module14.9 JP_Module15.9 JP_Module16.9 U8.21(IO13) ; harness SPI.MISO
SPI_BUS.MOSI: D1.1(Line-1) JP_Module1.7 JP_Module2.7 JP_Module3.7 JP_Module4.7 JP_Module5.7 JP_Module6.7 JP_Module7.7 JP_Module8.7 JP_Module9.7 JP_Module10.7 JP_Module11.7 JP_Module12.7 JP_Module13.7 JP_Module14.7 JP_Module15.7 JP_Module16.7 U8.19(IO11) ; harness SPI.MOSI
SPI_BUS.SCLK: D1.2(Line-2) JP_Module1.8 JP_Module2.8 JP_Module3.8 JP_Module4.8 JP_Module5.8 JP_Module6.8 JP_Module7.8 JP_Module8.8 JP_Module9.8 JP_Module10.8 JP_Module11.8 JP_Module12.8 JP_Module13.8 JP_Module14.8 JP_Module15.8 JP_Module16.8 U8.20(IO12) ; harness SPI.SCLK
SW_0: R1.6 SW_10.2 U1.5(D6)
SW_1: R2.2 SW_1.2 U1.13(D2)
SW_2: R2.3 SW_2.2 U1.12(D1)
SW_3: R2.4 SW_3.2 U1.11(D0)
SW_4: R4.1 SW_4.2 U2.14(D3)
SW_5: R4.2 SW_5.2 U2.13(D2)
SW_6: R4.3 SW_6.2 U2.12(D1)
SW_7: R4.4 SW_7.2 U2.11(D0)
SW_8: R1.8 SW_8.2 U1.3(D4)
SW_9: R1.7 SW_9.2 U1.4(D5)
SW_': R10.4 SW_'1.2 U5.11(D0)
SW_,: R14.6 SW_,1.2 U9.5(D6)
SW_-: R1.5 SW_-1.2 U1.6(D7)
SW_.: R14.5 SW_.1.2 U9.6(D7)
SW_/: R19.8 SW_/1.2 U11.3(D4)
SW_;: R10.3 SW_;1.2 U5.12(D1)
SW_=: R3.8 SW_=1.2 U2.3(D4)
SW~{_}: R5.8 SW_\1.2 U3.3(D4)
SW_A: R7.8 SW_A1.2 U4.3(D4)
SW_B: R11.5 SW_B1.2 U7.6(D7)
SW_BACKSPACE: R3.7 SW_BACKSPACE1.2 U2.4(D5)
SW_C: R11.7 SW_C1.2 U7.4(D5)
SW_CAPSLOCK: R10.1 SW_CAPSLOCK1.2 U5.14(D3)
SW_D: R7.6 SW_D1.2 U4.5(D6)
SW_DEL: R19.5 SW_DEL1.2 U11.6(D7)
SW_DOWN: R15.1 SW_DOWN1.2 U9.14(D3)
SW_E: R6.2 SW_E1.2 U3.13(D2)
SW_ENTER: R12.1 SW_ENTER1.2 U7.14(D3)
SW_ESC: R2.1 SW_ESC1.2 U1.14(D3)
SW_F: R7.5 SW_F1.2 U4.6(D7)
SW_FUNC: R15.4 SW_FUNC1.2 U9.11(D0)
SW_G: R9.8 SW_G1.2 U5.3(D4)
SW_H: R9.7 SW_H1.2 U5.4(D5)
SW_I: R8.3 SW_I1.2 U4.12(D1)
SW_J: R9.6 SW_J1.2 U5.5(D6)
SW_K: R9.5 SW_K1.2 U5.6(D7)
SW_L: R10.2 SW_L1.2 U5.13(D2)
SW_LALT: R20.2 SW_LALT1.2 U11.13(D2)
SW_LCTRL: R20.4 SW_LCTRL1.2 U11.11(D0)
SW_LEFT: R15.2 SW_LEFT1.2 U9.13(D2)
SW_LOS: R20.3 SW_LOS1.2 U11.12(D1)
SW_LSB: R5.6 SW_[1.2 U3.5(D6)
SW_LSHIFT: R12.2 SW_LSHIFT1.2 U7.13(D2)
SW_M: R14.7 SW_M1.2 U9.4(D5)
SW_MENU: R15.3 SW_MENU1.2 U9.12(D1)
SW_N: R14.8 SW_N1.2 U9.3(D4)
SW_O: R8.4 SW_O1.2 U4.11(D0)
SW_P: R5.5 SW_P1.2 U3.6(D7)
SW_POWER: R41.2 SW_POWER1.1 U8.23(IO21) ; port SW_POWER
SW_Q: R3.5 SW_Q1.2 U2.6(D7)
SW_R: R6.3 SW_R1.2 U3.12(D1)
SW_RIGHT: R12.4 SW_RIGHT1.2 U7.11(D0)
SW_RSB: R5.7 SW_]1.2 U3.4(D5)
SW_RSHIFT: R19.7 SW_RSHIFT1.2 U11.4(D5)
SW_S: R7.7 SW_S1.2 U4.4(D5)
SW_SPACE: R20.1 SW_SPACE1.2 U11.14(D3)
SW_T: R6.4 SW_T1.2 U3.11(D0)
SW_TAB: R3.6 SW_TAB1.2 U2.5(D6)
SW_U: R8.2 SW_U1.2 U4.13(D2)
SW_UP: R19.6 SW_UP1.2 U11.5(D6)
SW_V: R11.6 SW_V1.2 U7.5(D6)
SW_W: R6.1 SW_W1.2 U3.14(D3)
SW_X: R11.8 SW_X1.2 U7.3(D4)
SW_Y: R8.1 SW_Y1.2 U4.14(D3)
SW_Z: R12.3 SW_Z1.2 U7.12(D1)
TCK: U8.32(IO39)
TDI: U8.34(IO41)
TDO: U8.33(IO40)
TMS: U8.35(IO42)
TOUCH0: U12.8(ELE0)
TOUCH1: U12.9(ELE1)
TOUCH2: U12.10(ELE2)
TOUCH3: U12.11(ELE3)
TOUCH4: U12.12(ELE4/LED0)
TOUCH5: U12.13(ELE5/LED1)
TOUCH6: U12.14(ELE6/LED2)
TOUCH7: U12.15(ELE7/LED3)
TOUCH8: U12.16(ELE8/LED4)
TOUCH9: U12.17(ELE9/LED5)
TOUCH10: U12.18(ELE10/LED6)
TOUCH11: U12.19(ELE11/LED7)
TOUCH12: U10.8(ELE0)
TOUCH13: U10.9(ELE1)
TOUCH14: U10.10(ELE2)
TOUCH15: U10.11(ELE3)
TOUCH16: U10.12(ELE4/LED0)
TOUCH17: U10.13(ELE5/LED1)
TOUCH18: U10.14(ELE6/LED2)
TOUCH19: U10.15(ELE7/LED3)
TOUCH20: U10.16(ELE8/LED4)
TOUCH21: U10.17(ELE9/LED5)
TOUCH22: U10.18(ELE10/LED6)
TOUCH23: U10.19(ELE11/LED7)
UART_BUS.RX: U8.25(IO48) U_AUTH1.5(P3.0/ADC8/RxD/INT4) ; harness *.RX, harness UART.RX
UART_BUS.TX: U8.24(IO47) U_AUTH1.6(P3.1/ADC9/TxD) ; harness *.TX, harness UART.TX
NetC3_2: C3.2 U10.5(VREG)
NetC5_2: C5.2 U12.5(VREG)
NetC8_2: C8.2 C9.2 C10.2 C19.2 C20.2 C21.2 C22.2 SW4.1(VOUT) SW4.5(VOUT) SW5.1(VOUT) SW5.5(VOUT) U14.10(VIN) U14.11(VIN) U16.10(VIN) U16.11(VIN)
NetC16_2: C16.2 U14.1(VINA) U14.12(EN) U14.13(PS/SYNC)
NetC27_2: C27.2 U16.1(VINA) U16.13(PS/SYNC)
NetDE1_1: DE1.1 DE2.1 U8.15(IO3)
NetJP_USB1_1: JP_USB1.1 JP_USB1.2 JP_USB1.3 JP_USB1.12 JP_USB1.13 JP_USB1.14 R23.2 SW1.3(VIN)
NetL1_1: L1.1 U14.6(L2) U14.7(L2)
NetL1_2: L1.2 U14.8(L1) U14.9(L1)
NetL2_1: L2.1 U16.6(L2) U16.7(L2)
NetL2_2: L2.2 U16.8(L1) U16.9(L1)
NetLED1_4: LED1.4(DOUT) LED2.2(DIN)
NetLED2_4: LED2.4(DOUT) LED3.2(DIN)
NetLED3_4: LED3.4(DOUT) LED4.2(DIN)
NetLED4_4: LED4.4(DOUT) LED5.2(DIN)
NetLED5_4: LED5.4(DOUT) LED6.2(DIN)
NetLED6_4: LED6.4(DOUT) LED7.2(DIN)
NetLED7_4: LED7.4(DOUT) LED8.2(DIN)
NetLED8_4: LED8.4(DOUT) LED9.2(DIN)
NetLED9_4: LED9.4(DOUT) LED10.2(DIN)
NetLED10_4: LED10.4(DOUT) LED11.2(DIN)
NetLED11_4: LED11.4(DOUT) LED12.2(DIN)
NetLED12_4: LED12.4(DOUT) LED13.2(DIN)
NetLED13_4: LED13.4(DOUT) LED14.2(DIN)
NetLED14_4: LED14.4(DOUT) LED15.2(DIN)
NetLED15_4: LED15.4(DOUT) LED16.2(DIN)
NetLED16_4: LED16.4(DOUT) LED17.2(DIN)
NetLED17_4: LED17.4(DOUT) LED18.2(DIN)
NetLED18_4: LED18.4(DOUT) LED19.2(DIN)
NetLED19_4: LED19.4(DOUT) LED20.2(DIN)
NetLED20_4: LED20.4(DOUT) SW_ESC1.4(DIN)
NetR16_1: R16.1 U8.13(IO19)
NetR17_1: R17.1 U8.14(IO20)
NetR18_2: R18.2 U10.7(REXT)
NetR21_2: R21.2 U12.7(REXT)
NetR24_1: R24.1 U13.7(IREF)
NetR25_1: R25.1 U13.6(IMIN)
NetR28_1: R28.1 R29.2 U14.3(FB)
NetR32_1: R32.1 R50.2 U16.3(FB)
NetSW4_4: SW4.4(EN) U15.4(Y)
NetSW_1_4: SW_1.4(DIN) SW_ESC1.6(DOUT)
NetSW_1_6: SW_1.6(DOUT) SW_2.4(DIN)
NetSW_2_6: SW_2.6(DOUT) SW_3.4(DIN)
NetSW_3_6: SW_3.6(DOUT) SW_4.4(DIN)
NetSW_4_6: SW_4.6(DOUT) SW_5.4(DIN)
NetSW_5_6: SW_5.6(DOUT) SW_6.4(DIN)
NetSW_6_6: SW_6.6(DOUT) SW_7.4(DIN)
NetSW_7_6: SW_7.6(DOUT) SW_8.4(DIN)
NetSW_8_6: SW_8.6(DOUT) SW_9.4(DIN)
NetSW_9_6: SW_9.6(DOUT) SW_10.4(DIN)
NetSW_10_6: SW_10.6(DOUT) SW_-1.4(DIN)
NetSW_'1_4: SW_'1.4(DIN) SW_;1.6(DOUT)
NetSW_'1_6: SW_'1.6(DOUT) SW_ENTER1.4(DIN)
NetSW_,1_4: SW_,1.4(DIN) SW_M1.6(DOUT)
NetSW_,1_6: SW_,1.6(DOUT) SW_.1.4(DIN)
NetSW_-1_6: SW_-1.6(DOUT) SW_=1.4(DIN)
NetSW_.1_6: SW_.1.6(DOUT) SW_/1.4(DIN)
NetSW_/1_6: SW_/1.6(DOUT) SW_RSHIFT1.4(DIN)
NetSW_;1_4: SW_;1.4(DIN) SW_L1.6(DOUT)
NetSW_=1_6: SW_=1.6(DOUT) SW_BACKSPACE1.4(DIN)
NetSW_[1_4: SW_[1.4(DIN) SW_P1.6(DOUT)
NetSW_[1_6: SW_[1.6(DOUT) SW_]1.4(DIN)
NetSW~{_}1_4: SW_\1.4(DIN) SW_]1.6(DOUT)
NetSW~{_}1_6: SW_\1.6(DOUT) SW_CAPSLOCK1.4(DIN)
NetSW_A1_4: SW_A1.4(DIN) SW_CAPSLOCK1.6(DOUT)
NetSW_A1_6: SW_A1.6(DOUT) SW_S1.4(DIN)
NetSW_B1_4: SW_B1.4(DIN) SW_V1.6(DOUT)
NetSW_B1_6: SW_B1.6(DOUT) SW_N1.4(DIN)
NetSW_BACKSPACE1_6: SW_BACKSPACE1.6(DOUT) SW_TAB1.4(DIN)
NetSW_C1_4: SW_C1.4(DIN) SW_X1.6(DOUT)
NetSW_C1_6: SW_C1.6(DOUT) SW_V1.4(DIN)
NetSW_D1_4: SW_D1.4(DIN) SW_S1.6(DOUT)
NetSW_D1_6: SW_D1.6(DOUT) SW_F1.4(DIN)
NetSW_DEL1_4: SW_DEL1.4(DIN) SW_UP1.6(DOUT)
NetSW_DEL1_6: SW_DEL1.6(DOUT) SW_LCTRL1.4(DIN)
NetSW_DOWN1_4: SW_DOWN1.4(DIN) SW_LEFT1.6(DOUT)
NetSW_DOWN1_6: SW_DOWN1.6(DOUT) SW_RIGHT1.4(DIN)
NetSW_E1_4: SW_E1.4(DIN) SW_W1.6(DOUT)
NetSW_E1_6: SW_E1.6(DOUT) SW_R1.4(DIN)
NetSW_ENTER1_6: SW_ENTER1.6(DOUT) SW_LSHIFT1.4(DIN)
NetSW_F1_6: SW_F1.6(DOUT) SW_G1.4(DIN)
NetSW_FUNC1_4: SW_FUNC1.4(DIN) SW_SPACE1.6(DOUT)
NetSW_FUNC1_6: SW_FUNC1.6(DOUT) SW_MENU1.4(DIN)
NetSW_G1_6: SW_G1.6(DOUT) SW_H1.4(DIN)
NetSW_H1_6: SW_H1.6(DOUT) SW_J1.4(DIN)
NetSW_I1_4: SW_I1.4(DIN) SW_U1.6(DOUT)
NetSW_I1_6: SW_I1.6(DOUT) SW_O1.4(DIN)
NetSW_J1_6: SW_J1.6(DOUT) SW_K1.4(DIN)
NetSW_K1_6: SW_K1.6(DOUT) SW_L1.4(DIN)
NetSW_LALT1_4: SW_LALT1.4(DIN) SW_LOS1.6(DOUT)
NetSW_LALT1_6: SW_LALT1.6(DOUT) SW_SPACE1.4(DIN)
NetSW_LCTRL1_6: SW_LCTRL1.6(DOUT) SW_LOS1.4(DIN)
NetSW_LEFT1_4: SW_LEFT1.4(DIN) SW_MENU1.6(DOUT)
NetSW_LSHIFT1_6: SW_LSHIFT1.6(DOUT) SW_Z1.4(DIN)
NetSW_M1_4: SW_M1.4(DIN) SW_N1.6(DOUT)
NetSW_O1_6: SW_O1.6(DOUT) SW_P1.4(DIN)
NetSW_Q1_4: SW_Q1.4(DIN) SW_TAB1.6(DOUT)
NetSW_Q1_6: SW_Q1.6(DOUT) SW_W1.4(DIN)
NetSW_R1_6: SW_R1.6(DOUT) SW_T1.4(DIN)
NetSW_RSHIFT1_6: SW_RSHIFT1.6(DOUT) SW_UP1.4(DIN)
NetSW_T1_6: SW_T1.6(DOUT) SW_Y1.4(DIN)
NetSW_U1_4: SW_U1.4(DIN) SW_Y1.6(DOUT)
NetSW_X1_4: SW_X1.4(DIN) SW_Z1.6(DOUT)
NetU1_9: U1.9(Q7) U2.10(DS)
NetU2_9: U2.9(Q7) U3.10(DS)
NetU3_9: U3.9(Q7) U4.10(DS)
NetU4_9: U4.9(Q7) U5.10(DS)
NetU5_9: U5.9(Q7) U7.10(DS)
NetU7_9: U7.9(Q7) U9.10(DS)
NetU9_9: U9.9(Q7) U11.10(DS)

Not connected (* = marked no-connect by the designer): JP_I2C 0; R34 8; SW_RIGHT1 6(DOUT); U1 7(*Q7) 10(DS)*; U2 7(*Q7); U3 7(*Q7); U4 7(*Q7); U5 7(*Q7); U7 7(*Q7); U8 16(IO46) 22(IO14) 26(IO45) 28(IO35)* 29(IO36)* 30(IO37)* 31(IO38)*; U9 7(*Q7); U11 7(*Q7); U13 2(~{PPR}); U14 14(PG); U15 1(NC); U16 14(PG); U_AUTH1 1(MCLKO/RST/P5.4) 3(P5.5) 7(P3.2/ADC10/INT0/SCLK_4/I2CSCL_4) 8(P3.3/ADC11/INT1/MISO_4/I2CSDA_4)

## Layout directives
differential pair: ESP32_USB.USB_D_N, ESP32_USB.USB_D_P

## Notes on the sheet
- (in symbol ESP32-S3-WROOM-1U-N16R8, part A) 1 of 2
- (in symbol ESP32-S3-WROOM-1U-N16R8, part B) 2 of 2

## Library data of the parts
C1-C31 = C: 贴片电容; BOM名称: 无极性贴片电容; 联系卖家，免费查找封装: 唯一出售店铺网址https://shop463601444.taobao.com
D1 = AZ1045: TVS阵列; 联系卖家，免费查找封装: 唯一出售店铺网址https://shop463601444.taobao.com; BOM名称: TVS阵列; 属性: AZ1045-04F
DE1 DE2 = DEBUG: 调试断点焊盘; 联系卖家，免费查找封装: 唯一出售店铺网址https://shop463601444.taobao.com; 封装库来自淘宝卖家ID：黄晶宝石: 其他店铺购入均为盗版假冒封装库，请立即申请退款; BOM名称: 调试断点焊盘
DZ1 = 1N4625: 5.1V/0.5W稳压管; 联系卖家，免费查找封装: 唯一出售店铺网址https://shop463601444.taobao.com; BOM名称: 5.1V/0.5W稳压管
JP_BATT = Header 2: 2P连接器; 联系卖家，免费技术支持: 唯一出售店铺网址https://shop463601444.taobao.com; 联系卖家 免费技术支持: 封装库来自淘宝卖家ID：黄晶宝石; BOM名称: 2P连接器
JP_I2C = Header 6: 6P连接器; 封装库来自淘宝卖家ID：黄晶宝石: 唯一出售店铺网址https://shop463601444.taobao.com; 联系卖家 免费查找封装: 封装库来自淘宝卖家ID：黄晶宝石; BOM名称: 6P连接器; 联系卖家 免费技术支持: 封装库来自淘宝卖家ID：黄晶宝石
JP_Module1-JP_Module16 = FPC-16P: FPC连接器; 版权归属: 源创客; BOM名称: FPC连接器; 学习资源: www.ooocke.com
JP_USB1 = FPC-14P: FPC连接器; 版权归属: 源创客; BOM名称: FPC连接器; 学习资源: www.ooocke.com
L1 L2 = L-Molding Choke: 一体成型电感; 联系卖家，免费查找封装: 唯一出售店铺网址https://shop463601444.taobao.com; BOM名称: 一体成型电感
R1-R12 R14 R15 R19 R20 R34 = R-8P4R: 贴片4P排阻; BOM名称: 贴片网络排阻; 联系卖家，免费查找封装: 唯一出售店铺网址https://shop463601444.taobao.com
R13 R16-R18 R21-R33 R35-R41 R50 = R: 贴片电阻; 联系卖家，免费查找封装: 唯一出售店铺网址https://shop463601444.taobao.com; BOM名称: 贴片电阻
SW_1-SW_10 SW_'1 SW_,1 SW_-1 SW_.1 SW_/1 SW_;1 SW_=1 SW_[1 SW_\1 SW_]1 SW_A1 SW_B1 SW_BACKSPACE1 SW_C1 SW_CAPSLOCK1 SW_D1 SW_DEL1 SW_DOWN1 SW_E1 SW_ENTER1 SW_ESC1 SW_F1 SW_FUNC1 SW_G1 SW_H1 SW_I1 SW_J1 SW_K1 SW_L1 SW_LALT1 SW_LCTRL1 SW_LEFT1 SW_LOS1 SW_LSHIFT1 SW_M1 SW_MENU1 SW_N1 SW_O1 SW_P1 SW_Q1 SW_R1 SW_RIGHT1 SW_RSHIFT1 SW_S1 SW_SPACE1 SW_T1 SW_TAB1 SW_U1 SW_UP1 SW_V1 SW_W1 SW_X1 SW_Y1 SW_Z1 = SWITCH
U1-U5 U7 U9 U11 = 74HC165PW,118: No Description Available; Mfr_Name: Nexperia; Copyright: Copyright (C) 2022 Ultra Librarian. All rights reserved.; Manufacturer_Part_Number: 74HC165PW,118; RefDes: RefDes; Type: DEV
U8 = ESP32-S3-WROOM-1U-N16R8: No Description Available; Mfr_Name: Espressif Systems; Copyright: Copyright (C) 2022 Ultra Librarian. All rights reserved.; Manufacturer_Part_Number: ESP32-S3-WROOM-1U-N16R8; RefDes: RefDes; Type: Type
U14 U16 = TPS63020QDSJTQ1: No Description Available; Mfr_Name: Texas Instruments; Copyright: Copyright (C) 2022 Ultra Librarian. All rights reserved.; Manufacturer_Part_Number: TPS63020QDSJTQ1; RefDes: RefDes; Type: DEV